# EAGLE design ext (EAGLE 9.6.1)

## Sheet 1 of 2
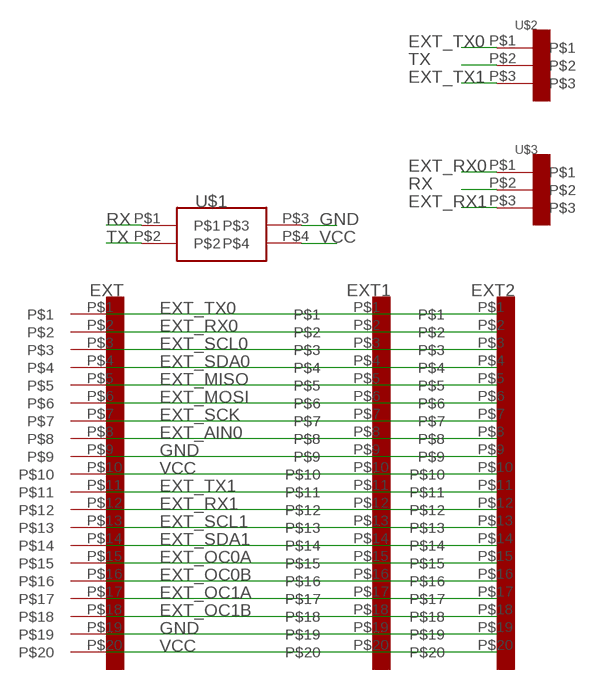
[diagram p0: schematic, sheet 1]

### Parts
EXT  CON_DIL_20  [CON_DIL_20]
EXT1  CON_DIL_20  [CON_DIL_20]
EXT2  CON_DIL_20  [CON_DIL_20]
U$1  CON_DIL_2X2  [CON_DIL_2X2]
U$2  CON_DIL_3  [CON_DIL_3]
U$3  CON_DIL_3  [CON_DIL_3]

### Nets
EXT_AIN0: EXT1.P$8 EXT2.P$8 EXT.P$8
EXT_MISO: EXT1.P$5 EXT2.P$5 EXT.P$5
EXT_MOSI: EXT1.P$6 EXT2.P$6 EXT.P$6
EXT_OC0A: EXT1.P$15 EXT2.P$15 EXT.P$15
EXT_OC0B: EXT1.P$16 EXT2.P$16 EXT.P$16
EXT_OC1A: EXT1.P$17 EXT2.P$17 EXT.P$17
EXT_OC1B: EXT1.P$18 EXT2.P$18 EXT.P$18
EXT_RX0: EXT1.P$2 EXT2.P$2 EXT.P$2 U$3.P$1
EXT_RX1: EXT1.P$12 EXT2.P$12 EXT.P$12 U$3.P$3
EXT_SCK: EXT1.P$7 EXT2.P$7 EXT.P$7
EXT_SCL0: EXT1.P$3 EXT2.P$3 EXT.P$3
EXT_SCL1: EXT1.P$13 EXT2.P$13 EXT.P$13
EXT_SDA0: EXT1.P$4 EXT2.P$4 EXT.P$4
EXT_SDA1: EXT1.P$14 EXT2.P$14 EXT.P$14
EXT_TX0: EXT1.P$1 EXT2.P$1 EXT.P$1 U$2.P$1
EXT_TX1: EXT1.P$11 EXT2.P$11 EXT.P$11 U$2.P$3
GND: EXT1.P$9 EXT1.P$19 EXT2.P$9 EXT2.P$19 EXT.P$9 EXT.P$19 U$1.P$3
RX: U$1.P$1 U$3.P$2
TX: U$1.P$2 U$2.P$2
VCC: EXT1.P$10 EXT1.P$20 EXT2.P$10 EXT2.P$20 EXT.P$10 EXT.P$20 U$1.P$4

## Sheet 2 of 2

## Library data of the parts
EXT EXT1 EXT2 = connector:CON_DIL_20
U$1 = connector:CON_DIL_2X2
U$2 U$3 = connector:CON_DIL_3

## Board
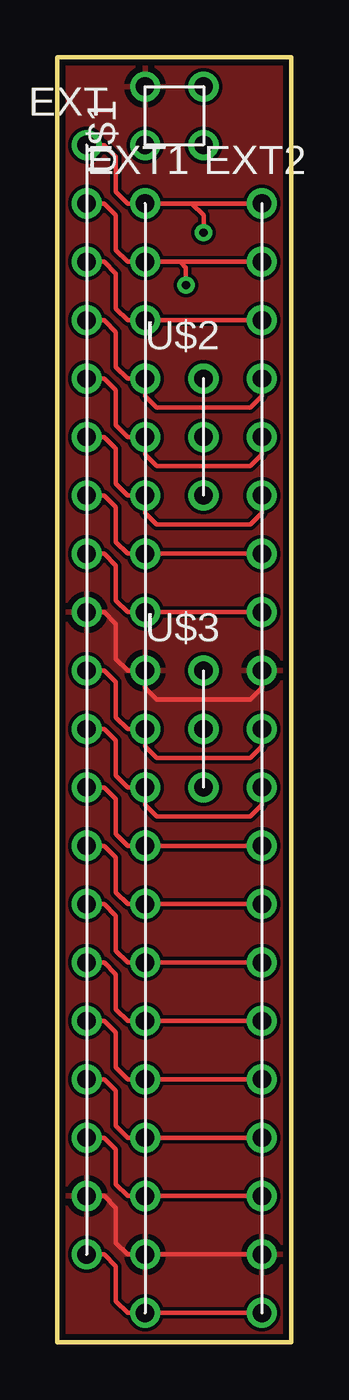
[diagram p1: board, top side]
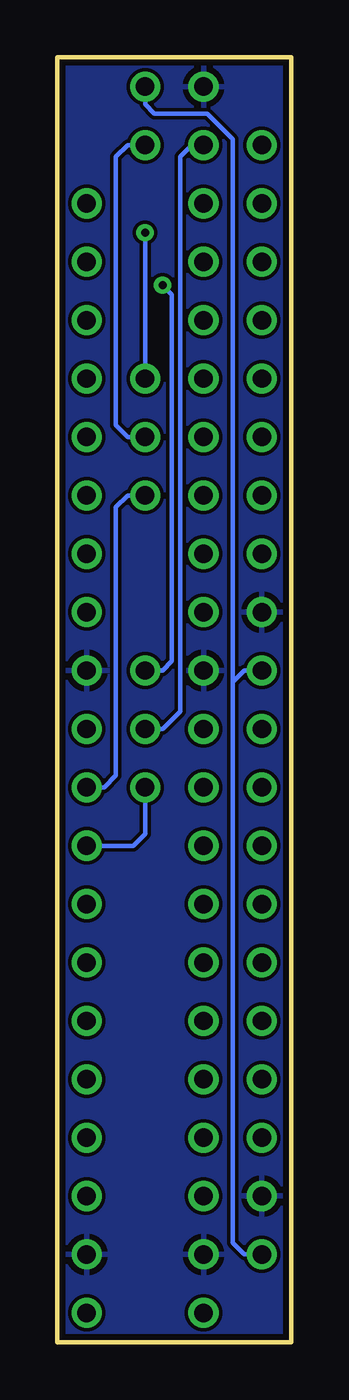
[diagram p2: board, bottom side, seen from below]

Size 10.16 x 55.88 mm. Coordinates in mm from the lower left corner, seen from the top.
Outline: 0,0 10.16,0 10.16,55.88 0,55.88 0,0
Copper layers (1*16): Top 0.035mm / dielectric 1.5mm / Bottom 0.035mm
Design rules "default *": minimum track width 6mil, minimum drill 0.35mm, track to track 6mil, track to pad 6mil, pad to pad 6mil, via to via 6mil, smd to smd 6mil, copper to edge 10mil, drill to drill 6mil, minimum pad ring 10mil, minimum via ring 8mil, stop-mask expansion 4mil, vias tented up to drill 0mil, thermal gap 10mil

### Footprints (pad centres in the part's own frame; a part is rotated, then mirrored left to right if it is on the bottom)
CON_DIL_20 = drill 0.8: P$1 -2.54,5.08; P$2 -2.54,2.54; P$3 -2.54,0; P$4 -2.54,-2.54; P$5 -2.54,-5.08; P$6 -2.54,-7.62; P$7 -2.54,-10.16; P$8 -2.54,-12.7; P$9 -2.54,-15.24; P$10 -2.54,-17.78; P$11 -2.54,-20.32; P$12 -2.54,-22.86; P$13 -2.54,-25.4; P$14 -2.54,-27.94; P$15 -2.54,-30.48; P$16 -2.54,-33.02; P$17 -2.54,-35.56; P$18 -2.54,-38.1; P$19 -2.54,-40.64; P$20 -2.54,-43.18
CON_DIL_2X2 = drill 0.8: P$1 -1.27,2.54; P$2 -1.27,0; P$3 1.27,2.54; P$4 1.27,0
CON_DIL_3 = drill 0.8: P$1 0,2.54; P$2 0,0; P$3 0,-2.54

### Placement (x,y rotation side)
EXT  3.81,46.99 0 top
EXT1  6.35,44.45 0 top
EXT2  11.43,44.45 0 top
U$1  6.35,53.34 90 top
U$2  6.35,39.37 0 top
U$3  6.35,26.67 0 top

### Tracks (layer width: path | path; a pad name or v marks a point on that pad's centre or on a via)
EXT_AIN0
  Top 0.203: EXT2.P$8 EXT1.P$8 3.05,31.75 2.54,32.26 2.54,33.78 2.03,34.29 EXT.P$8
EXT_MISO
  Top 0.203: EXT2.P$5 8.89,38.61 8.38,38.1 4.32,38.1 3.81,38.61 EXT1.P$5 3.05,39.37 2.54,39.88 2.54,41.4 2.03,41.91 EXT.P$5
EXT_MOSI
  Top 0.203: EXT2.P$6 8.89,36.07 8.38,35.56 4.32,35.56 3.81,36.07 EXT1.P$6 3.05,36.83 2.54,37.34 2.54,38.86 2.03,39.37 EXT.P$6
EXT_OC0A
  Top 0.203: EXT2.P$15 EXT1.P$15 3.05,13.97 2.54,14.48 2.54,16 2.03,16.51 EXT.P$15
EXT_OC0B
  Top 0.203: EXT2.P$16 EXT1.P$16 3.05,11.43 2.54,11.94 2.54,13.46 2.03,13.97 EXT.P$16
EXT_OC1A
  Top 0.203: EXT2.P$17 EXT1.P$17 3.05,8.89 2.54,9.4 2.54,10.92 2.03,11.43 EXT.P$17
EXT_OC1B
  Top 0.203: EXT2.P$18 EXT1.P$18 3.05,6.35 2.54,6.86 2.54,8.38 2.03,8.89 EXT.P$18
EXT_RX0  (via drill 0.35)
  Top 0.203: EXT2.P$2 5.33,46.99 | 5.33,46.99 EXT1.P$2 3.05,46.99 2.54,47.5 2.54,49.02 2.03,49.53 EXT.P$2 | 5.33,46.99 5.59,46.74 v5.59,45.97
  Bottom 0.203: U$3.P$1 5.59,29.21 5.18,29.62 5.18,45.57 v5.59,45.97
EXT_RX1
  Top 0.203: EXT2.P$12 EXT1.P$12 3.05,21.59 2.54,22.1 2.54,23.62 2.03,24.13 EXT.P$12
  Bottom 0.203: EXT2.P$12 6.86,21.59 6.35,22.1 U$3.P$3
EXT_SCK
  Top 0.203: EXT2.P$7 EXT1.P$7 3.05,34.29 2.54,34.8 2.54,36.32 2.03,36.83 EXT.P$7
EXT_SCL0
  Top 0.203: EXT2.P$3 EXT1.P$3 3.05,44.45 2.54,44.96 2.54,46.48 2.03,46.99 EXT.P$3
EXT_SCL1
  Top 0.203: EXT2.P$13 EXT1.P$13 3.05,19.05 2.54,19.56 2.54,21.08 2.03,21.59 EXT.P$13
EXT_SDA0
  Top 0.203: EXT2.P$4 8.89,41.15 8.38,40.64 4.32,40.64 3.81,41.15 EXT1.P$4 3.05,41.91 2.54,42.42 2.54,43.94 2.03,44.45 EXT.P$4
EXT_SDA1
  Top 0.203: EXT2.P$14 EXT1.P$14 3.05,16.51 2.54,17.02 2.54,18.54 2.03,19.05 EXT.P$14
EXT_TX0  (via drill 0.35)
  Top 0.203: EXT2.P$1 5.84,49.53 | 5.84,49.53 EXT1.P$1 3.05,49.53 2.54,50.04 2.54,51.56 2.03,52.07 EXT.P$1 | v6.35,48.26 6.35,49.02 5.84,49.53
  Bottom 0.203: U$2.P$1 v6.35,48.26
EXT_TX1
  Top 0.203: EXT2.P$11 8.89,23.37 8.38,22.86 4.32,22.86 3.81,23.37 EXT1.P$11 3.05,24.13 2.54,24.64 2.54,26.16 2.03,26.67 EXT.P$11
  Bottom 0.203: U$2.P$3 7.11,36.83 7.62,36.32 7.62,24.64 8.13,24.13 EXT2.P$11
GND
  Top 0.203: EXT2.P$19 EXT1.P$19 3.05,3.81 2.54,4.32 2.54,5.84 2.03,6.35 EXT.P$19 | EXT2.P$9 8.89,28.45 8.38,27.94 4.32,27.94 3.81,28.45 EXT1.P$9 3.05,29.21 2.54,29.72 2.54,31.24 2.03,31.75 EXT.P$9
  pour Top: 0,55.88 10.16,55.88 10.16,0 0,0
  pour Bottom: 0,55.88 10.16,55.88 10.16,0 0,0
RX
  Bottom 0.203: U$3.P$2 5.59,26.67 4.83,27.43 4.83,51.56 4.32,52.07 U$1.P$1
TX
  Bottom 0.203: U$2.P$2 7.11,39.37 7.62,39.88 7.62,51.56 7.11,52.07 U$1.P$2
VCC
  Top 0.203: EXT2.P$20 EXT1.P$20 3.05,1.27 2.54,1.78 2.54,3.3 2.03,3.81 EXT.P$20 | EXT2.P$10 8.89,25.91 8.38,25.4 4.32,25.4 3.81,25.91 EXT1.P$10 3.05,26.67 2.54,27.18 2.54,28.7 2.03,29.21 EXT.P$10
  Bottom 0.203: EXT.P$20 2.03,3.81 2.54,4.32 2.54,28.7 | 2.54,28.7 2.54,52.32 3.66,53.44 5.94,53.44 6.35,53.85 U$1.P$4 | EXT.P$10 2.03,29.21 2.54,28.7

### Text on the board
Document: GND | VCC | RX | TX | TX0 | TX1 | RX0 | RX1